# EAGLE design CBB-XBEE-r02 (EAGLE 7.2.0)
DATABASE: ./../BOM/logic-supply-db.txt
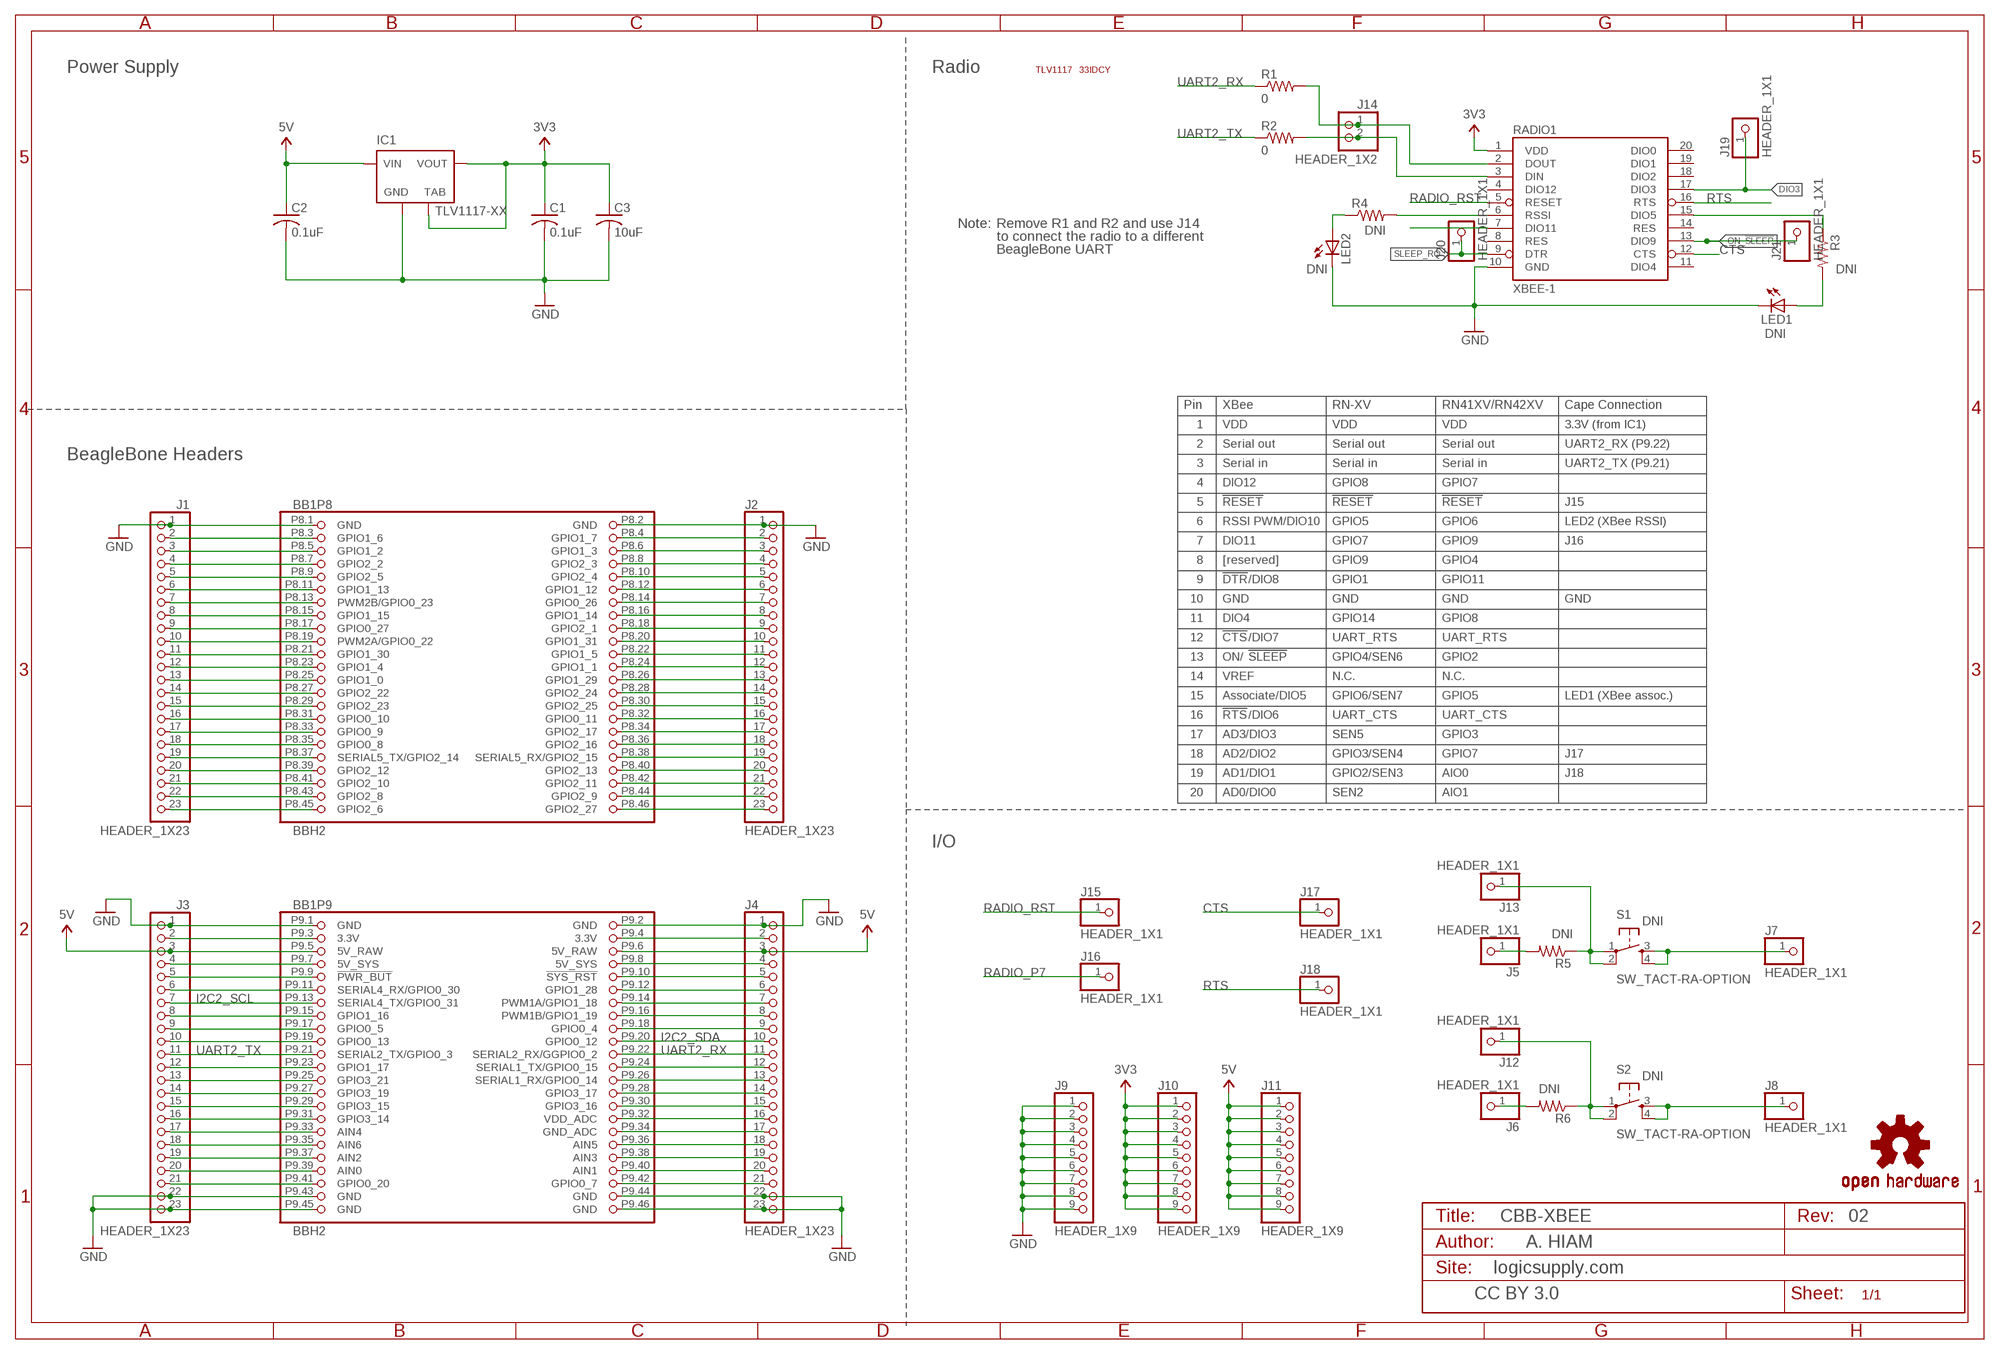
[diagram p0: schematic, sheet 1]

## Parts
BB1  BBH2  [BB_CAPE_TOP]
C1  0.1uF  C0805  [C0805]
C2  0.1uF  C0805  [C0805]
C3  10uF  C0805  [C0805]
IC1  TLV1117-XX  [SOT223]
J1  HEADER_1X23  [HEADER_1X23]
J2  HEADER_1X23  [HEADER_1X23]
J3  HEADER_1X23  [HEADER_1X23]
J4  HEADER_1X23  [HEADER_1X23]
J5  HEADER_1X1  [HEADER_1X1]
J6  HEADER_1X1  [HEADER_1X1]
J7  HEADER_1X1  [HEADER_1X1]
J8  HEADER_1X1  [HEADER_1X1]
J9  HEADER_1X9  [HEADER_1X9]
J10  HEADER_1X9  [HEADER_1X9]
J11  HEADER_1X9  [HEADER_1X9]
J12  HEADER_1X1  [HEADER_1X1]
J13  HEADER_1X1  [HEADER_1X1]
J14  HEADER_1X2  [HEADER_1X2]
J15  HEADER_1X1  [HEADER_1X1]
J16  HEADER_1X1  [HEADER_1X1]
J17  HEADER_1X1  [HEADER_1X1]
J18  HEADER_1X1  [HEADER_1X1]
J19  HEADER_1X1  [HEADER_1X1]
J20  HEADER_1X1  [HEADER_1X1]
J21  HEADER_1X1  [HEADER_1X1]
LED1  LEDCHIPLED_0805  [CHIPLED_0805]
LED2  LEDCHIPLED_0805  [CHIPLED_0805]
R1  0  R0805  [R0805]
R2  0  R0805  [R0805]
R3  R0805  [R0805]
R4  R0805  [R0805]
R5  R0207/10  [0207/10]
R6  R0207/10  [0207/10]
RADIO1  XBEE-1  [XBEE]
S1  SW_TACT-RA-OPTION  [TACT-PTH-RA-OPTION]
S2  SW_TACT-RA-OPTION  [TACT-PTH-RA-OPTION]
U$7  OSHW-LOGOM  [OSHW-LOGO-M]

## Nets
3V3: C1.1 C3.1 IC1.2(VOUT) IC1.4(TAB) J10.1 J10.2 J10.3 J10.4 J10.5 J10.6 J10.7 J10.8 J10.9 RADIO1.1(VDD)
5V: BB1.P9.5(P9:5V_RAW) BB1.P9.6(P9:5V_RAW) C2.1 IC1.3(VIN) J3.3 J4.3 J11.1 J11.2 J11.3 J11.4 J11.5 J11.6 J11.7 J11.8 J11.9
CTS: J17.1 RADIO1.12(CTS)
DIO3: J19.1 RADIO1.17(DIO3)
GND: BB1.P8.1(P8:GND) BB1.P8.2(P8:GND) BB1.P9.1(P9:GND) BB1.P9.2(P9:GND) BB1.P9.43(P9:GND) BB1.P9.44(P9:GND) BB1.P9.45(P9:GND) BB1.P9.46(P9:GND) C1.2 C2.2 C3.2 IC1.1(GND) J1.1 J2.1 J3.1 J3.22 J3.23 J4.1 J4.22 J4.23 J9.1 J9.2 J9.3 J9.4 J9.5 J9.6 J9.7 J9.8 J9.9 LED1.C LED2.C RADIO1.10(GND)
I2C2_SCL: BB1.P9.19(P9:GPIO0_13) J3.10
I2C2_SDA: BB1.P9.20(P9:GPIO0_12) J4.10
N$1: BB1.P9.14(P9:PWM1A/GPIO1_18) J4.7
N$2: BB1.P8.3(P8:GPIO1_6) J1.2
N$3: BB1.P8.5(P8:GPIO1_2) J1.3
N$4: BB1.P8.7(P8:GPIO2_2) J1.4
N$5: BB1.P8.9(P8:GPIO2_5) J1.5
N$6: BB1.P8.11(P8:GPIO1_13) J1.6
N$7: BB1.P8.13(P8:PWM2B/GPIO0_23) J1.7
N$8: BB1.P8.15(P8:GPIO1_15) J1.8
N$9: BB1.P8.17(P8:GPIO0_27) J1.9
N$10: BB1.P8.19(P8:PWM2A/GPIO0_22) J1.10
N$11: BB1.P8.21(P8:GPIO1_30) J1.11
N$12: BB1.P8.23(P8:GPIO1_4) J1.12
N$13: R3.1 RADIO1.15(DIO5)
N$14: BB1.P9.3(P9:3.3V) J3.2
N$15: BB1.P9.4(P9:3.3V) J4.2
N$17: BB1.P8.25(P8:GPIO1_0) J1.13
N$18: BB1.P8.27(P8:GPIO2_22) J1.14
N$19: BB1.P8.29(P8:GPIO2_23) J1.15
N$20: BB1.P8.31(P8:GPIO0_10) J1.16
N$21: BB1.P8.33(P8:GPIO0_9) J1.17
N$23: BB1.P8.35(P8:GPIO0_8) J1.18
N$24: BB1.P8.37(P8:SERIAL5_TX/GPIO2_14) J1.19
N$25: BB1.P8.39(P8:GPIO2_12) J1.20
N$26: BB1.P8.41(P8:GPIO2_10) J1.21
N$27: BB1.P8.43(P8:GPIO2_8) J1.22
N$28: BB1.P8.45(P8:GPIO2_6) J1.23
N$32: J13.1 R5.1 S1.1 S1.2
N$33: BB1.P9.10(P9:!SYS_RST) J4.5
N$34: R4.2 RADIO1.6(RSSI)
N$35: LED1.A R3.2
N$36: BB1.P9.16(P9:PWM1B/GPIO1_19) J4.8
N$37: BB1.P9.18(P9:GPIO0_4) J4.9
N$38: BB1.P9.7(P9:5V_SYS) J3.4
N$39: BB1.P9.24(P9:SERIAL1_TX/GPIO0_15) J4.12
N$40: BB1.P9.26(P9:SERIAL1_RX/GPIO0_14) J4.13
N$41: BB1.P9.28(P9:GPIO3_17) J4.14
N$42: BB1.P9.30(P9:GPIO3_16) J4.15
N$43: BB1.P9.32(P9:VDD_ADC) J4.16
N$44: BB1.P9.34(P9:GND_ADC) J4.17
N$45: BB1.P9.36(P9:AIN5) J4.18
N$46: BB1.P9.38(P9:AIN3) J4.19
N$47: BB1.P9.40(P9:AIN1) J4.20
N$48: BB1.P9.42(P9:GPIO0_7) J4.21
N$50: J12.1 R6.1 S2.1 S2.2
N$51: J8.1 S2.3 S2.4
N$52: J7.1 S1.3 S1.4
N$53: BB1.P9.8(P9:5V_SYS) J4.4
N$54: J5.1 R5.2
N$55: BB1.P9.9(P9:!PWR_BUT) J3.5
N$56: BB1.P9.11(P9:SERIAL4_RX/GPIO0_30) J3.6
N$57: BB1.P9.13(P9:SERIAL4_TX/GPIO0_31) J3.7
N$58: BB1.P9.15(P9:GPIO1_16) J3.8
N$59: BB1.P9.17(P9:GPIO0_5) J3.9
N$60: J6.1 R6.2
N$61: BB1.P9.23(P9:GPIO1_17) J3.12
N$62: BB1.P9.25(P9:GPIO3_21) J3.13
N$63: BB1.P9.27(P9:GPIO3_19) J3.14
N$64: BB1.P9.29(P9:GPIO3_15) J3.15
N$65: BB1.P9.31(P9:GPIO3_14) J3.16
N$66: BB1.P9.33(P9:AIN4) J3.17
N$67: BB1.P9.35(P9:AIN6) J3.18
N$68: BB1.P9.37(P9:AIN2) J3.19
N$69: BB1.P9.39(P9:AIN0) J3.20
N$70: BB1.P9.41(P9:GPIO0_20) J3.21
N$74: BB1.P8.4(P8:GPIO1_7) J2.2
N$75: BB1.P8.6(P8:GPIO1_3) J2.3
N$76: BB1.P8.8(P8:GPIO2_3) J2.4
N$77: BB1.P8.10(P8:GPIO2_4) J2.5
N$78: BB1.P8.12(P8:GPIO1_12) J2.6
N$79: BB1.P8.14(P8:GPIO0_26) J2.7
N$80: BB1.P8.16(P8:GPIO1_14) J2.8
N$81: BB1.P8.18(P8:GPIO2_1) J2.9
N$82: BB1.P8.20(P8:GPIO1_31) J2.10
N$83: BB1.P8.22(P8:GPIO1_5) J2.11
N$84: BB1.P8.24(P8:GPIO1_1) J2.12
N$85: BB1.P8.26(P8:GPIO1_29) J2.13
N$86: BB1.P8.28(P8:GPIO2_24) J2.14
N$87: BB1.P8.30(P8:GPIO2_25) J2.15
N$88: BB1.P8.32(P8:GPIO0_11) J2.16
N$89: BB1.P8.34(P8:GPIO2_17) J2.17
N$90: BB1.P8.36(P8:GPIO2_16) J2.18
N$91: BB1.P8.38(P8:SERIAL5_RX/GPIO2_15) J2.19
N$92: BB1.P8.40(P8:GPIO2_13) J2.20
N$93: BB1.P8.42(P8:GPIO2_11) J2.21
N$94: BB1.P8.44(P8:GPIO2_9) J2.22
N$95: BB1.P8.46(P8:GPIO2_27) J2.23
N$96: LED2.A R4.1
N$98: J14.2 R2.2 RADIO1.3(DIN)
N$99: J14.1 R1.2 RADIO1.2(DOUT)
N$100: BB1.P9.12(P9:GPIO1_28) J4.6
ON_!SLEEP: J21.1 RADIO1.13(DIO9)
RADIO_P7: J16.1 RADIO1.7(DIO11)
RADIO_RST: J15.1 RADIO1.5(RESET)
RTS: J18.1 RADIO1.16(RTS)
SLEEP_RQ: J20.1 RADIO1.9(DTR)
UART2_RX: BB1.P9.22(P9:SERIAL2_RX/GGPIO0_2) J4.11 R1.1
UART2_TX: BB1.P9.21(P9:SERIAL2_TX/GPIO0_3) J3.11 R2.1
Unconnected: RADIO1.4(DIO12) RADIO1.8(RES) RADIO1.11(DIO4) RADIO1.14(RES) RADIO1.18(DIO2) RADIO1.19(DIO1) RADIO1.20(DIO0)

## Notes on the sheet
- Power Supply | Radio | TLV1117‑33IDCY
- Note: | Remove R1 and R2 and use J14
- DNI
- to connect the radio to a different
- BeagleBone UART
- DNI | DNI
- DNI
- Pin | XBee | RN-XV | RN41XV/RN42XV | Cape Connection
- 1 | VDD | VDD | VDD | 3.3V (from IC1)
- 2 | Serial out | Serial out | Serial out | UART2_RX (P9.22)
- BeagleBone Headers
- 3 | Serial in | Serial in | Serial in | UART2_TX (P9.21)
- 4 | DIO12 | GPIO8 | GPIO7
- 5 | !RESET | !RESET | !RESET | J15
- 6 | RSSI PWM/DIO10 | GPIO5 | GPIO6 | LED2 (XBee RSSI)
- 7 | DIO11 | GPIO7 | GPIO9 | J16
- 8 | [reserved] | GPIO9 | GPIO4
- 9 | !DTR | /DIO8 | GPIO1 | GPIO11
- 10 | GND | GND | GND | GND
- 11 | DIO4 | GPIO14 | GPIO8
- 12 | !CTS | /DIO7 | UART_RTS | UART_RTS
- 13 | ON/ | !SLEEP | GPIO4/SEN6 | GPIO2
- 14 | VREF | N.C. | N.C.
- 15 | Associate/DIO5 | GPIO6/SEN7 | GPIO5 | LED1 (XBee assoc.)
- 16 | !RTS | /DIO6 | UART_CTS | UART_CTS
- 17 | AD3/DIO3 | SEN5 | GPIO3
- 18 | AD2/DIO2 | GPIO3/SEN4 | GPIO7 | J17
- 19 | AD1/DIO1 | GPIO2/SEN3 | AIO0 | J18
- 20 | AD0/DIO0 | SEN2 | AIO1
- I/O
- DNI
- DNI
- DNI
- DNI
- CBB-XBEE | 02
- A. HIAM
- logicsupply.com
- CC BY 3.0

## Library data of the parts
BB1 = logic-supply:BBH: BeagleBone header sub-assembly BBH1 outdated, use BBH2 or BBH3 only
C1-C3 = logic-supply:C
IC1 = logic-supply:TLV1117-XX: TI TLV1117 series fixed LDO regulators
J1-J4 = logic-supply:HEADER_1X23
J5-J8 J12 J13 J15-J21 = logic-supply:HEADER_1X1
J9-J11 = logic-supply:HEADER_1X9
J14 = logic-supply:HEADER_1X2
LED1 LED2 = adafruit:LED: LED OSRAM: - CHIPLED LG R971, LG N971, LY N971, LG Q971, LY Q971, LO R971, LY R971 LH N974, LH R974 LS Q976, LO Q976, LY Q976 LO Q996 - Hyper CHIPLED LW Q18S LB Q993, LB Q99A, LB R99A - SideLED LS A670, LO A670, LY A670, LG A670, LP A670 LB A673, LV A673, LT A673, LW A673 LH A674 LY A675 LS A676, LA A676, LO A676, LY A676, LW A676 LS A679, LY A679, LG A679 - Hyper Micro SIDELED® LS Y876, LA Y876, LO Y876, LY Y876 LT Y87S - SmartLED LW L88C, LW L88S LB L89C, LB L89S, LG L890 LS L89K, LO L89K, LY L89K LS L896, LA L896, LO L896, LY L896 - TOPLED LS T670, LO T670, LY T670, LG T670, LP T670 LSG T670, LSP T670, LSY T670, LOP T670, LYG T670 LG T671, LOG T671, LSG T671 LB T673, LV T673, LT T673, LW T673 LH T674 LS T676, LA T676, LO T676, LY T676, LB T676, LH T676, LSB T676, LW T676 LB T67C, LV T67C, LT T67C, LS T67K, LO T67K, LY T67K, LW E67C LS E67B, LA E67B, LO E67B, LY E67B, LB E67C, LV E67C, LT E67C LW T67C LS T679, LY T679, LG T679 LS T770, LO T770, LY T770, LG T770, LP T770 LB T773, LV T773, LT T773, LW T773 LH T774 LS E675, LA E675, LY E675, LS T675 LS T776, LA T776, LO T776, LY T776, LB T776 LHGB T686 LT T68C, LB T68C - Hyper Mini TOPLED® LB M676 - Mini TOPLED Santana® LG M470 LS M47K, LO M47K, LY M47K Source: http://www.osram.convergy.de/
R1-R6 = logic-supply:R
RADIO1 = logic-supply:XBEE-1: Xbee module footprint Derived from SparkFun-RF.lbr
S1 S2 = logic-supply:SW_TACT
U$7 = logic-supply:OSHW-LOGO: Open Source Hardware Logo This logo indicates the piece of hardware it is found on incorporates a OSHW license and/or adheres to the definition of open source hardware found here: http://freedomdefined.org/OSHW From SparkFun-Aesthetics.lbr

## Board
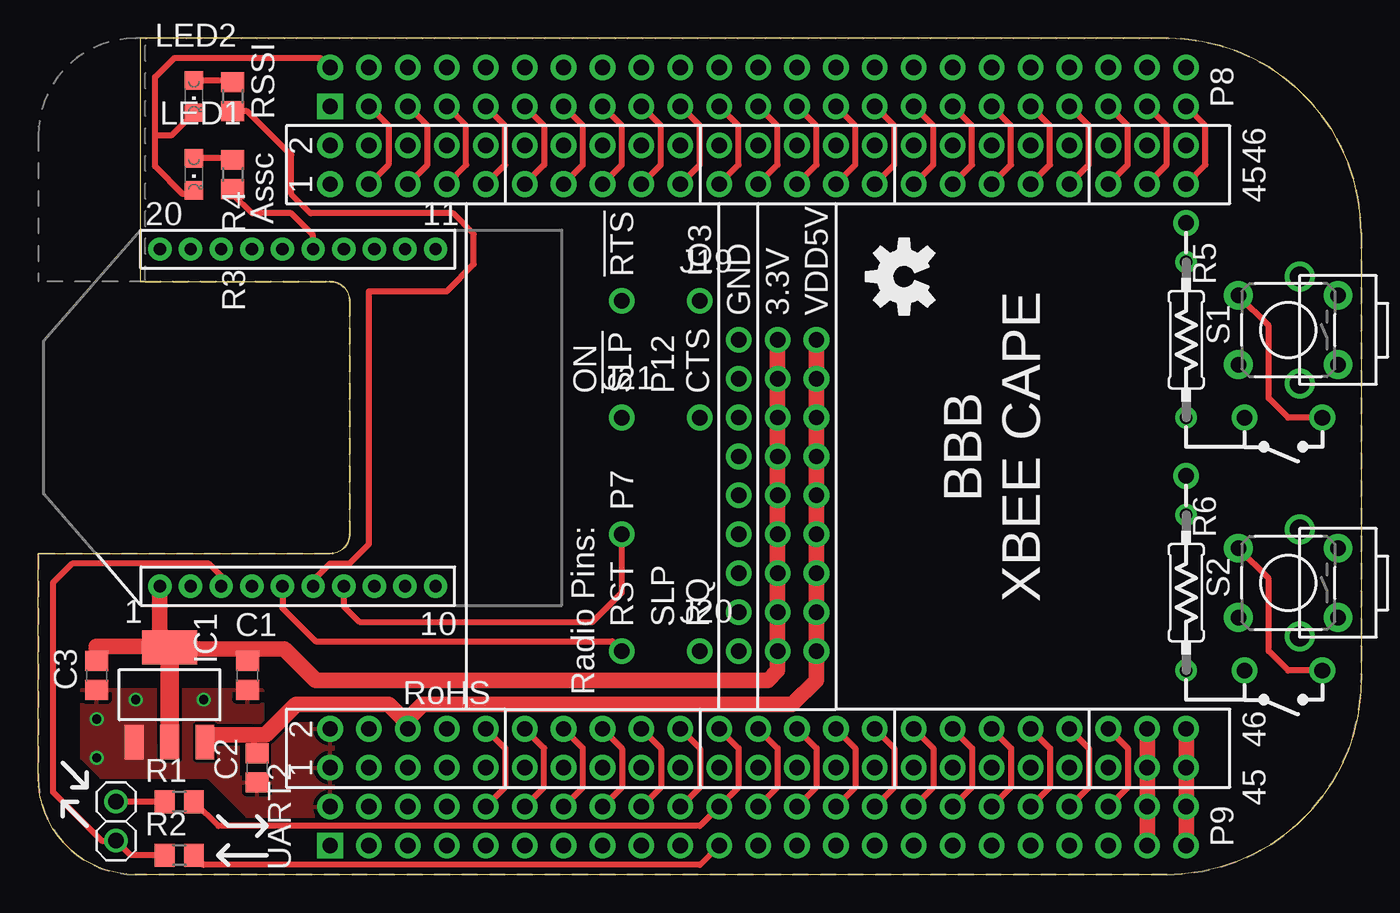
[diagram p1: board, top side]
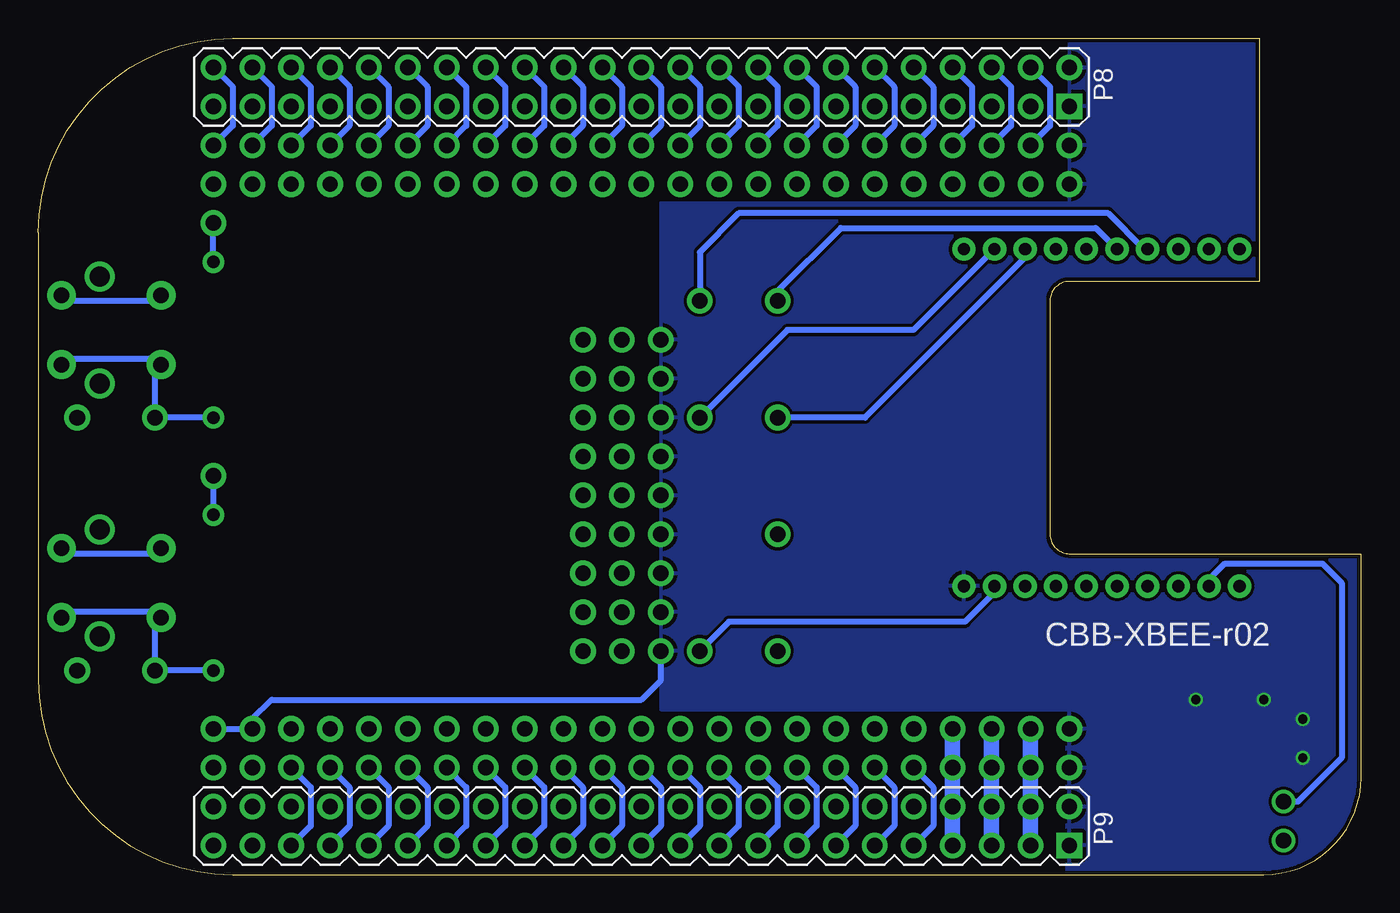
[diagram p2: board, bottom side, seen from below]

Size 86.36 x 54.61 mm. Coordinates in mm from the lower left corner, seen from the top.
Outline: 86.36,41.91 86.36,12.7 arc-90 73.66,0 6.35,0 arc-90 0,6.35 0,20.95 19.05,20.95 arc90 20.32,22.23 20.32,37.47 arc90 19.05,38.73 6.67,38.73 6.67,54.61 73.66,54.61 arc-90 86.36,41.91
Copper layers (1*16): Top 0.035mm / dielectric 1.5mm / Bottom 0.035mm
Design rules "Dirty8TS": minimum track width 5mil, minimum drill 12mil, track to track 8mil, track to pad 8mil, pad to pad 8mil, via to via 8mil, smd to smd 0mil, copper to edge 10mil, drill to drill 10mil, minimum pad ring 10mil, minimum via ring 6mil, stop-mask expansion 2mil, vias tented up to drill 25mil, thermal gap 10mil

### Footprints (pad centres in the part's own frame; a part is rotated, then mirrored left to right if it is on the bottom)
BB_CAPE_TOP = drill 1 pad 1.676 square: P8.1 50.165,19.05; P9.1 1.905,19.05 | drill 1 pad 1.676: P8.2 52.705,19.05; P8.3 50.165,21.59; P8.4 52.705,21.59; P8.5 50.165,24.13; P8.6 52.705,24.13; P8.7 50.165,26.67; P8.8 52.705,26.67; P8.9 50.165,29.21; P8.10 52.705,29.21; P8.11 50.165,31.75; P8.12 52.705,31.75; P8.13 50.165,34.29; P8.14 52.705,34.29; P8.15 50.165,36.83; P8.16 52.705,36.83; P8.17 50.165,39.37; P8.18 52.705,39.37; P8.19 50.165,41.91; P8.20 52.705,41.91; P8.21 50.165,44.45; P8.22 52.705,44.45; P8.23 50.165,46.99; P8.24 52.705,46.99; P8.25 50.165,49.53; P8.26 52.705,49.53; P8.27 50.165,52.07; P8.28 52.705,52.07; P8.29 50.165,54.61; P8.30 52.705,54.61; P8.31 50.165,57.15; P8.32 52.705,57.15; P8.33 50.165,59.69; P8.34 52.705,59.69; P8.35 50.165,62.23; P8.36 52.705,62.23; P8.37 50.165,64.77; P8.38 52.705,64.77; P8.39 50.165,67.31; P8.40 52.705,67.31; P8.41 50.165,69.85; P8.42 52.705,69.85; P8.43 50.165,72.39; P8.44 52.705,72.39; P8.45 50.165,74.93; P8.46 52.705,74.93; P9.2 4.445,19.05; P9.3 1.905,21.59; P9.4 4.445,21.59; P9.5 1.905,24.13; P9.6 4.445,24.13; P9.7 1.905,26.67; P9.8 4.445,26.67; P9.9 1.905,29.21; P9.10 4.445,29.21; P9.11 1.905,31.75; P9.12 4.445,31.75; P9.13 1.905,34.29; P9.14 4.445,34.29; P9.15 1.905,36.83; P9.16 4.445,36.83; P9.17 1.905,39.37; P9.18 4.445,39.37; P9.19 1.905,41.91; P9.20 4.445,41.91; P9.21 1.905,44.45; P9.22 4.445,44.45; P9.23 1.905,46.99; P9.24 4.445,46.99; P9.25 1.905,49.53; P9.26 4.445,49.53; P9.27 1.905,52.07; P9.28 4.445,52.07; P9.29 1.905,54.61; P9.30 4.445,54.61; P9.31 1.905,57.15; P9.32 4.445,57.15; P9.33 1.905,59.69; P9.34 4.445,59.69; P9.35 1.905,62.23; P9.36 4.445,62.23; P9.37 1.905,64.77; P9.38 4.445,64.77; P9.39 1.905,67.31; P9.40 4.445,67.31; P9.41 1.905,69.85; P9.42 4.445,69.85; P9.43 1.905,72.39; P9.44 4.445,72.39; P9.45 1.905,74.93; P9.46 4.445,74.93
C0805 = smd 1.3 x 1.5: 1 -0.95,0; 2 0.95,0
SOT223 = smd 1.219 x 2.235: 1 -2.311,-3.099; 2 0,-3.099; 3 2.311,-3.099 | smd 3.6 x 2.2: 4 0,3.099
HEADER_1X23 = drill 1 pad 1.676: 1 -27.94,0; 2 -25.4,0; 3 -22.86,0; 4 -20.32,0; 5 -17.78,0; 6 -15.24,0; 7 -12.7,0; 8 -10.16,0; 9 -7.62,0; 10 -5.08,0; 11 -2.54,0; 12 0,0; 13 2.54,0; 14 5.08,0; 15 7.62,0; 16 10.16,0; 17 12.7,0; 18 15.24,0; 19 17.78,0; 20 20.32,0; 21 22.86,0; 22 25.4,0; 23 27.94,0
HEADER_1X1 = drill 1.016 pad 1.676: 1 0,0
HEADER_1X9 = drill 1 pad 1.676: 1 0,0; 2 2.54,0; 3 5.08,0; 4 7.62,0; 5 10.16,0; 6 12.7,0; 7 15.24,0; 8 17.78,0; 9 20.32,0
HEADER_1X2 = drill 1.016: 1 0,0; 2 2.54,0
CHIPLED_0805 = smd 1.2 x 1.2: A 0,-1.05; C 0,1.05
R0805 = smd 1.3 x 1.5: 1 -0.95,0; 2 0.95,0
0207/10 = drill 0.813 pad 1.422: 1 -5.08,0; 2 5.08,0
XBEE = drill 0.8 pad 1.524: 1 -11,20; 2 -11,18; 3 -11,16; 4 -11,14; 5 -11,12; 6 -11,10; 7 -11,8; 8 -11,6; 9 -11,4; 10 -11,2; 11 11,2; 12 11,4; 13 11,6; 14 11,8; 15 11,10; 16 11,12; 17 11,14; 18 11,16; 19 11,18; 20 11,20
TACT-PTH-RA-OPTION = drill 1.016 pad 1.88: 1 -3.251,2.261; 2 3.251,2.261; 3 -3.251,-2.261; 4 3.251,-2.261 | drill 1.3: P$1 -0.75,3.5; P$2 -0.75,-3.5

### Placement (x,y rotation side)
BB1  0,0 90 bottom
C1  13.65,13.02 270 top
C2  14.29,6.99 270 top
C3  3.81,13.02 270 top
IC1  8.57,11.75 0 top
J1  46.99,45.09 0 top
J2  46.99,47.62 0 top
J3  46.99,6.99 0 top
J4  46.99,9.53 0 top
J5  74.93,42.55 0 top
J6  74.93,26.04 0 top
J7  83.82,29.84 0 top
J8  83.82,13.34 0 top
J9  45.72,14.61 90 top
J10  48.26,14.61 90 top
J11  50.8,14.61 90 top
J12  78.74,13.34 0 top
J13  78.74,29.84 0 top
J14  5.08,4.76 270 top
J15  38.1,14.61 0 top
J16  38.1,22.23 0 top
J17  43.18,29.84 0 top
J18  38.1,37.47 0 top
J19  43.18,37.47 0 top
J20  43.18,14.61 0 top
J21  38.1,29.84 0 top
LED1  10.16,45.72 180 top
LED2  10.16,50.8 180 top
R1  9.21,4.76 180 top
R2  9.21,1.27 180 top
R3  12.7,45.72 90 top
R4  12.7,50.8 270 top
R5  74.93,34.92 90 top
R6  74.93,18.41 90 top
RADIO1  27.94,29.84 90 top
S1  81.6,35.56 180 top
S2  81.6,19.05 180 top
U$7  56.52,39.05 90 top

### Tracks (layer width: path | path; a pad name or v marks a point on that pad's centre or on a via)
3V3
  Top 1.016: J10.6 J10.7 J10.8 J10.9 J10.5 J10.4 J10.3 J10.2 J10.1 48.26,13.34 47.62,12.7 18.1,12.7 16.06,14.73 13.97,14.73 | IC1.4 8.57,14.29 8.06,14.8 | RADIO1.1 7.94,15.8 8.06,15.68 8.06,14.8 | 9,14.73 IC1.4 | 8.06,14.8 7.97,14.89 3.78,14.89 C3.1 | IC1.4 8.68,14.73 13.97,14.73 | C1.1 13.97,14.73
  Top 1.219: IC1.2 8.57,14.29
5V
  Top 0.406: C2.1 13.97,9.12
  Top 1.016: J11.9 J11.8 J11.7 J11.6 J11.5 J11.4 J11.3 J11.2 J11.1 50.8,12.7 49.21,11.11 25.08,11.11 24.13,10.16 J4.3 24.13,9.84 22.86,11.11 16.83,11.11 14.83,9.12 13.97,9.12 11.35,9.12 IC1.3
  Bottom 1.016: J4.3 J3.3 BB1.P9.6 BB1.P9.5
CTS
  Bottom 0.406: J17.1 37.47,35.56 29.23,35.56 RADIO1.12
DIO3
  Bottom 0.406: RADIO1.17 14.18,40.84 16.51,43.18 40.64,43.18 43.18,40.64 J19.1
GND  (via drill 0.6)
  Top 0.406: LED1.C 9.94,44.45 9.42,44.45 7.62,46.25 7.62,48.26 | 7.62,48.26 7.62,52.07 8.89,53.34 18.41,53.34 BB1.P8.2 | LED2.C 8.67,48.26 7.62,48.26
  Top 1.016: BB1.P9.45 BB1.P9.46 J3.23 J4.23 | J4.22 J3.22 BB1.P9.44 BB1.P9.43
  Bottom 0.406: J4.23 J4.22 72.39,10.16 71.12,11.43 46.99,11.43 45.72,12.7 J9.1
  other vias: 6.35,11.43 3.81,7.62 10.79,11.43 3.81,10.16
  pour Bottom: 0.32,54.29 19.05,54.29 19.05,43.81 45.72,43.81 45.72,10.79 19.21,10.79 19.21,0.32 0.32,0.32
  pour Top: 2.86,7.62 2.86,12.06 14.61,12.06 14.61,9.21 13.02,9.21 13.02,6.35 15.24,6.35 15.24,9.84 19.21,9.84 19.21,3.81 13.65,3.81 11.11,6.35 4.13,6.35
  pour Top (no thermals): 5.08,10.16 7.3,10.16 7.3,6.99 5.08,6.99
I2C2_SCL
  Bottom 0.406: J3.10 40.64,5.71 40.64,3.17 BB1.P9.19
I2C2_SDA
  Top 0.406: J4.10 43.18,8.26 43.18,5.71 BB1.P9.20
N$1
  Top 0.406: BB1.P9.14 35.56,5.71 35.56,8.26 J4.7
N$2
  Top 0.406: BB1.P8.3 22.86,48.9 22.86,46.35 J1.2
N$3
  Top 0.406: J1.3 25.4,46.35 25.4,48.9 BB1.P8.5
N$4
  Top 0.406: J1.4 27.94,46.35 27.94,48.9 BB1.P8.7
N$5
  Top 0.406: J1.5 30.48,46.35 30.48,48.9 BB1.P8.9
N$6
  Top 0.406: BB1.P8.11 33.02,48.9 33.02,46.35 J1.6
N$7
  Top 0.406: J1.7 35.56,46.35 35.56,48.9 BB1.P8.13
N$8
  Top 0.406: J1.8 38.1,46.35 38.1,48.9 BB1.P8.15
N$9
  Top 0.406: J1.9 40.64,46.35 40.64,48.9 BB1.P8.17
N$10
  Top 0.406: J1.10 43.18,46.35 43.18,48.9 BB1.P8.19
N$11
  Top 0.406: J1.11 45.72,46.35 45.72,48.9 BB1.P8.21
N$12
  Top 0.406: J1.12 48.26,46.35 48.26,48.9 BB1.P8.23
N$13
  Top 0.406: RADIO1.15 17.94,41.75 16.51,43.18 13.97,43.18 12.7,44.45 R3.1
N$14
  Bottom 1.016: BB1.P9.3 J3.2
N$15
  Bottom 1.016: BB1.P9.4 J4.2
N$17
  Top 0.406: J1.13 50.8,46.35 50.8,48.9 BB1.P8.25
N$18
  Top 0.406: J1.14 53.34,46.35 53.34,48.9 BB1.P8.27
N$19
  Top 0.406: J1.15 55.88,46.35 55.88,48.9 BB1.P8.29
N$20
  Top 0.406: J1.16 58.42,46.35 58.42,48.9 BB1.P8.31
N$21
  Top 0.406: J1.17 60.96,46.35 60.96,48.9 BB1.P8.33
N$23
  Top 0.406: J1.18 63.5,46.35 63.5,48.9 BB1.P8.35
N$24
  Top 0.406: J1.19 66.04,46.35 66.04,48.9 BB1.P8.37
N$25
  Top 0.406: J1.20 68.58,46.35 68.58,48.9 BB1.P8.39
N$26
  Top 0.406: J1.21 71.12,46.35 71.12,48.9 BB1.P8.41
N$27
  Top 0.406: J1.22 73.66,46.35 73.66,48.9 BB1.P8.43
N$28
  Top 0.406: J1.23 76.2,46.35 76.2,48.9 BB1.P8.45
N$32
  Bottom 0.406: R5.1 J13.1 78.74,32.91 S1.2 78.38,33.3 78.74,33.66 84.49,33.66 S1.1
N$33
  Top 0.406: J4.5 30.48,8.26 30.48,5.71 BB1.P9.10
N$34
  Top 0.406: RADIO1.6 17.94,19.21 19.05,20.32 20.32,20.32 21.59,21.59 21.59,38.1 26.67,38.1 28.43,39.85 28.43,41.82 27.07,43.18 17.78,43.18 16.51,44.45 16.51,46.99 13.65,49.85 R4.2
N$35
  Top 0.406: R3.2 12.6,46.77 LED1.A
N$36
  Top 0.406: J4.8 38.1,8.26 38.1,5.71 BB1.P9.16
N$37
  Top 0.406: J4.9 40.64,8.26 40.64,5.71 BB1.P9.18
N$38
  Bottom 1.016: J3.4 BB1.P9.7
N$39
  Top 0.406: J4.12 48.26,8.26 48.26,5.71 BB1.P9.24
N$40
  Top 0.406: J4.13 50.8,8.26 50.8,5.71 BB1.P9.26
N$41
  Top 0.406: J4.14 53.34,8.26 53.34,5.71 BB1.P9.28
N$42
  Top 0.406: J4.15 55.88,8.26 55.88,5.71 BB1.P9.30
N$43
  Top 0.406: J4.16 58.42,8.26 58.42,5.71 BB1.P9.32
N$44
  Top 0.406: J4.17 60.96,8.26 60.96,5.71 BB1.P9.34
N$45
  Top 0.406: J4.18 63.5,8.26 63.5,5.71 BB1.P9.36
N$46
  Top 0.406: J4.19 66.04,8.26 66.04,5.71 BB1.P9.38
N$47
  Top 0.406: J4.20 68.58,8.26 68.58,5.71 BB1.P9.40
N$48
  Top 0.406: J4.21 71.12,8.26 71.12,5.71 BB1.P9.42
N$50
  Bottom 0.406: R6.1 J12.1 78.74,16.4 S2.2 78.38,16.79 78.74,17.14 84.49,17.14 S2.1
N$51
  Top 0.406: J8.1 81.6,13.34 80.33,14.61 80.33,19.33 S2.4
  Bottom 0.406: S2.4 78.38,21.31 78.74,20.95 84.49,20.95 S2.3
N$52
  Top 0.406: J7.1 81.6,29.84 80.33,31.11 80.33,35.84 S1.4
  Bottom 0.406: S1.4 78.38,37.82 78.74,37.47 84.49,37.47 S1.3
N$53
  Bottom 1.016: J4.4 BB1.P9.8
N$54
  Bottom 0.406: R5.2 J5.1
N$55
  Bottom 0.406: J3.5 27.94,5.71 27.94,3.17 BB1.P9.9
N$56
  Bottom 0.406: J3.6 30.48,5.71 30.48,3.17 BB1.P9.11
N$57
  Bottom 0.406: J3.7 33.02,5.71 33.02,3.17 BB1.P9.13
N$58
  Bottom 0.406: J3.8 35.56,5.71 35.56,3.17 BB1.P9.15
N$59
  Bottom 0.406: J3.9 38.1,5.71 38.1,3.17 BB1.P9.17
N$60
  Bottom 0.406: J6.1 R6.2
N$61
  Bottom 0.406: J3.12 45.72,5.71 45.72,3.17 BB1.P9.23
N$62
  Bottom 0.406: J3.13 48.26,5.71 48.26,3.17 BB1.P9.25
N$63
  Bottom 0.406: J3.14 50.8,5.71 50.8,3.17 BB1.P9.27
N$64
  Bottom 0.406: J3.15 53.34,5.71 53.34,3.17 BB1.P9.29
N$65
  Bottom 0.406: J3.16 55.88,5.71 55.88,3.17 BB1.P9.31
N$66
  Bottom 0.406: J3.17 58.42,5.71 58.42,3.17 BB1.P9.33
N$67
  Bottom 0.406: J3.18 60.96,5.71 60.96,3.17 BB1.P9.35
N$68
  Bottom 0.406: J3.19 63.5,5.71 63.5,3.17 BB1.P9.37
N$69
  Bottom 0.406: J3.20 66.04,5.71 66.04,3.17 BB1.P9.39
N$70
  Bottom 0.406: J3.21 68.58,5.71 68.58,3.17 BB1.P9.41
N$74
  Bottom 0.406: BB1.P8.4 20.32,51.44 20.32,48.9 J2.2
N$75
  Bottom 0.406: BB1.P8.6 22.86,51.44 22.86,48.9 J2.3
N$76
  Bottom 0.406: BB1.P8.8 25.4,51.44 25.4,48.9 J2.4
N$77
  Bottom 0.406: BB1.P8.10 27.94,51.44 27.94,48.9 J2.5
N$78
  Bottom 0.406: BB1.P8.12 30.48,51.44 30.48,48.9 J2.6
N$79
  Bottom 0.406: BB1.P8.14 33.02,51.44 33.02,48.9 J2.7
N$80
  Bottom 0.406: BB1.P8.16 35.56,51.44 35.56,48.9 J2.8
N$81
  Bottom 0.406: BB1.P8.18 38.1,51.44 38.1,48.9 J2.9
N$82
  Bottom 0.406: BB1.P8.20 40.64,51.44 40.64,48.9 J2.10
N$83
  Bottom 0.406: BB1.P8.22 43.18,51.44 43.18,48.9 J2.11
N$84
  Bottom 0.406: BB1.P8.24 45.72,51.44 45.72,48.9 J2.12
N$85
  Bottom 0.406: BB1.P8.26 48.26,51.44 48.26,48.9 J2.13
N$86
  Bottom 0.406: BB1.P8.28 50.8,51.44 50.8,48.9 J2.14
N$87
  Bottom 0.406: BB1.P8.30 53.34,51.44 53.34,48.9 J2.15
N$88
  Bottom 0.406: BB1.P8.32 55.88,51.44 55.88,48.9 J2.16
N$89
  Bottom 0.406: BB1.P8.34 58.42,51.44 58.42,48.9 J2.17
N$90
  Bottom 0.406: BB1.P8.36 60.96,51.44 60.96,48.9 J2.18
N$91
  Bottom 0.406: BB1.P8.38 63.5,51.44 63.5,48.9 J2.19
N$92
  Bottom 0.406: BB1.P8.40 66.04,51.44 66.04,48.9 J2.20
N$93
  Bottom 0.406: BB1.P8.42 68.58,51.44 68.58,48.9 J2.21
N$94
  Bottom 0.406: BB1.P8.44 71.12,51.44 71.12,48.9 J2.22
N$95
  Bottom 0.406: BB1.P8.46 73.66,51.44 73.66,48.9 J2.23
N$96
  Top 0.406: R4.1 12.6,51.85 LED2.A
N$98
  Top 0.406: RADIO1.3 11.94,19.49 11.11,20.32 2.22,20.32 0.95,19.05 0.95,5.4 4.13,2.22 J14.2 6.03,1.27 R2.2
N$99
  Top 0.406: R1.2 J14.1
  Bottom 0.406: RADIO1.2 9.94,19.27 8.89,20.32 2.54,20.32 1.27,19.05 1.27,7.62 4.13,4.76 J14.1
N$100
  Top 0.406: BB1.P9.12 33.02,5.71 33.02,8.26 J4.6
ON_!SLEEP
  Bottom 0.406: RADIO1.13 21.94,40.29 32.38,29.84 J21.1
RADIO_P7
  Top 0.406: J16.1 38.1,18.41 36.2,16.51 20.95,16.51 19.94,17.52 RADIO1.7
RADIO_RST
  Top 0.406: RADIO1.5 15.94,17.4 18.1,15.24 37.47,15.24 J15.1
RTS
  Bottom 0.406: J18.1 38.1,38.1 33.97,42.23 17.32,42.23 RADIO1.16
SLEEP_RQ
  Bottom 0.406: RADIO1.9 23.94,18.45 25.88,16.51 41.27,16.51 J20.1
UART2_RX
  Top 0.406: J4.11 45.72,8.26 45.72,5.71 BB1.P9.22 43.18,3.17 11.74,3.17 R1.1
UART2_TX
  Top 0.406: BB1.P9.21 43.18,0.64 10.79,0.64 R2.1
  Bottom 0.406: J3.11 43.18,5.71 43.18,3.17 BB1.P9.21

### Text on the board
tPlace: P8 | RSSI | 2 | 46 | 1 | 45 | 20 | Assc | 11 | !RTS | IO3 | GND | 3.3V | VDD5V | ON / !SLP | P12 / CTS | BBB / XBEE CAPE | P7 | 1 | 10 | RST | SLP / RQ | Radio Pins: | RoHS | 2 | 46 | 1 | 45 | P9 | UART2
bPlace: CBB-XBEE-r02